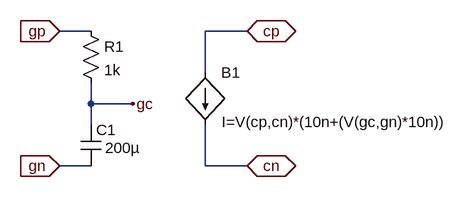
[diagram p0: schematic capteur.asc]
capteur.asc, the LTspice schematic file:
Version 4
SHEET 1 880 680
WIRE 16 64 -32 64
WIRE 256 64 192 64
WIRE 192 128 192 64
WIRE 16 176 16 144
WIRE 80 176 16 176
WIRE 16 208 16 176
WIRE 16 272 -32 272
WIRE 192 272 192 208
WIRE 256 272 192 272
FLAG 256 64 cp
IOPIN 256 64 BiDir
FLAG 256 272 cn
IOPIN 256 272 BiDir
FLAG -32 64 gp
IOPIN -32 64 In
FLAG -32 272 gn
IOPIN -32 272 In
FLAG 80 176 gc
SYMBOL bi 192 128 R0
WINDOW 3 25 76 Left 2
SYMATTR InstName B1
SYMATTR Value I=V(cp,cn)*(10n+(V(gc,gn)*10n))
SYMBOL res 0 48 R0
SYMATTR InstName R1
SYMATTR Value 1k
SYMBOL cap 0 208 R0
WINDOW 3 38 36 Left 2
SYMATTR InstName C1
SYMATTR Value 200µ

The netlist it stands for:
* capteur.asc
B1 cp cn I=V(cp,cn)*(10n+(V(gc,gn)*10n))
R1 gp gc 1k
C1 gc gn 200µ
.backanno
.end